# EAGLE design Grove - 12-bit Magnetic Rotary Position Sensor (AS5600) (EAGLE 9.2.2)
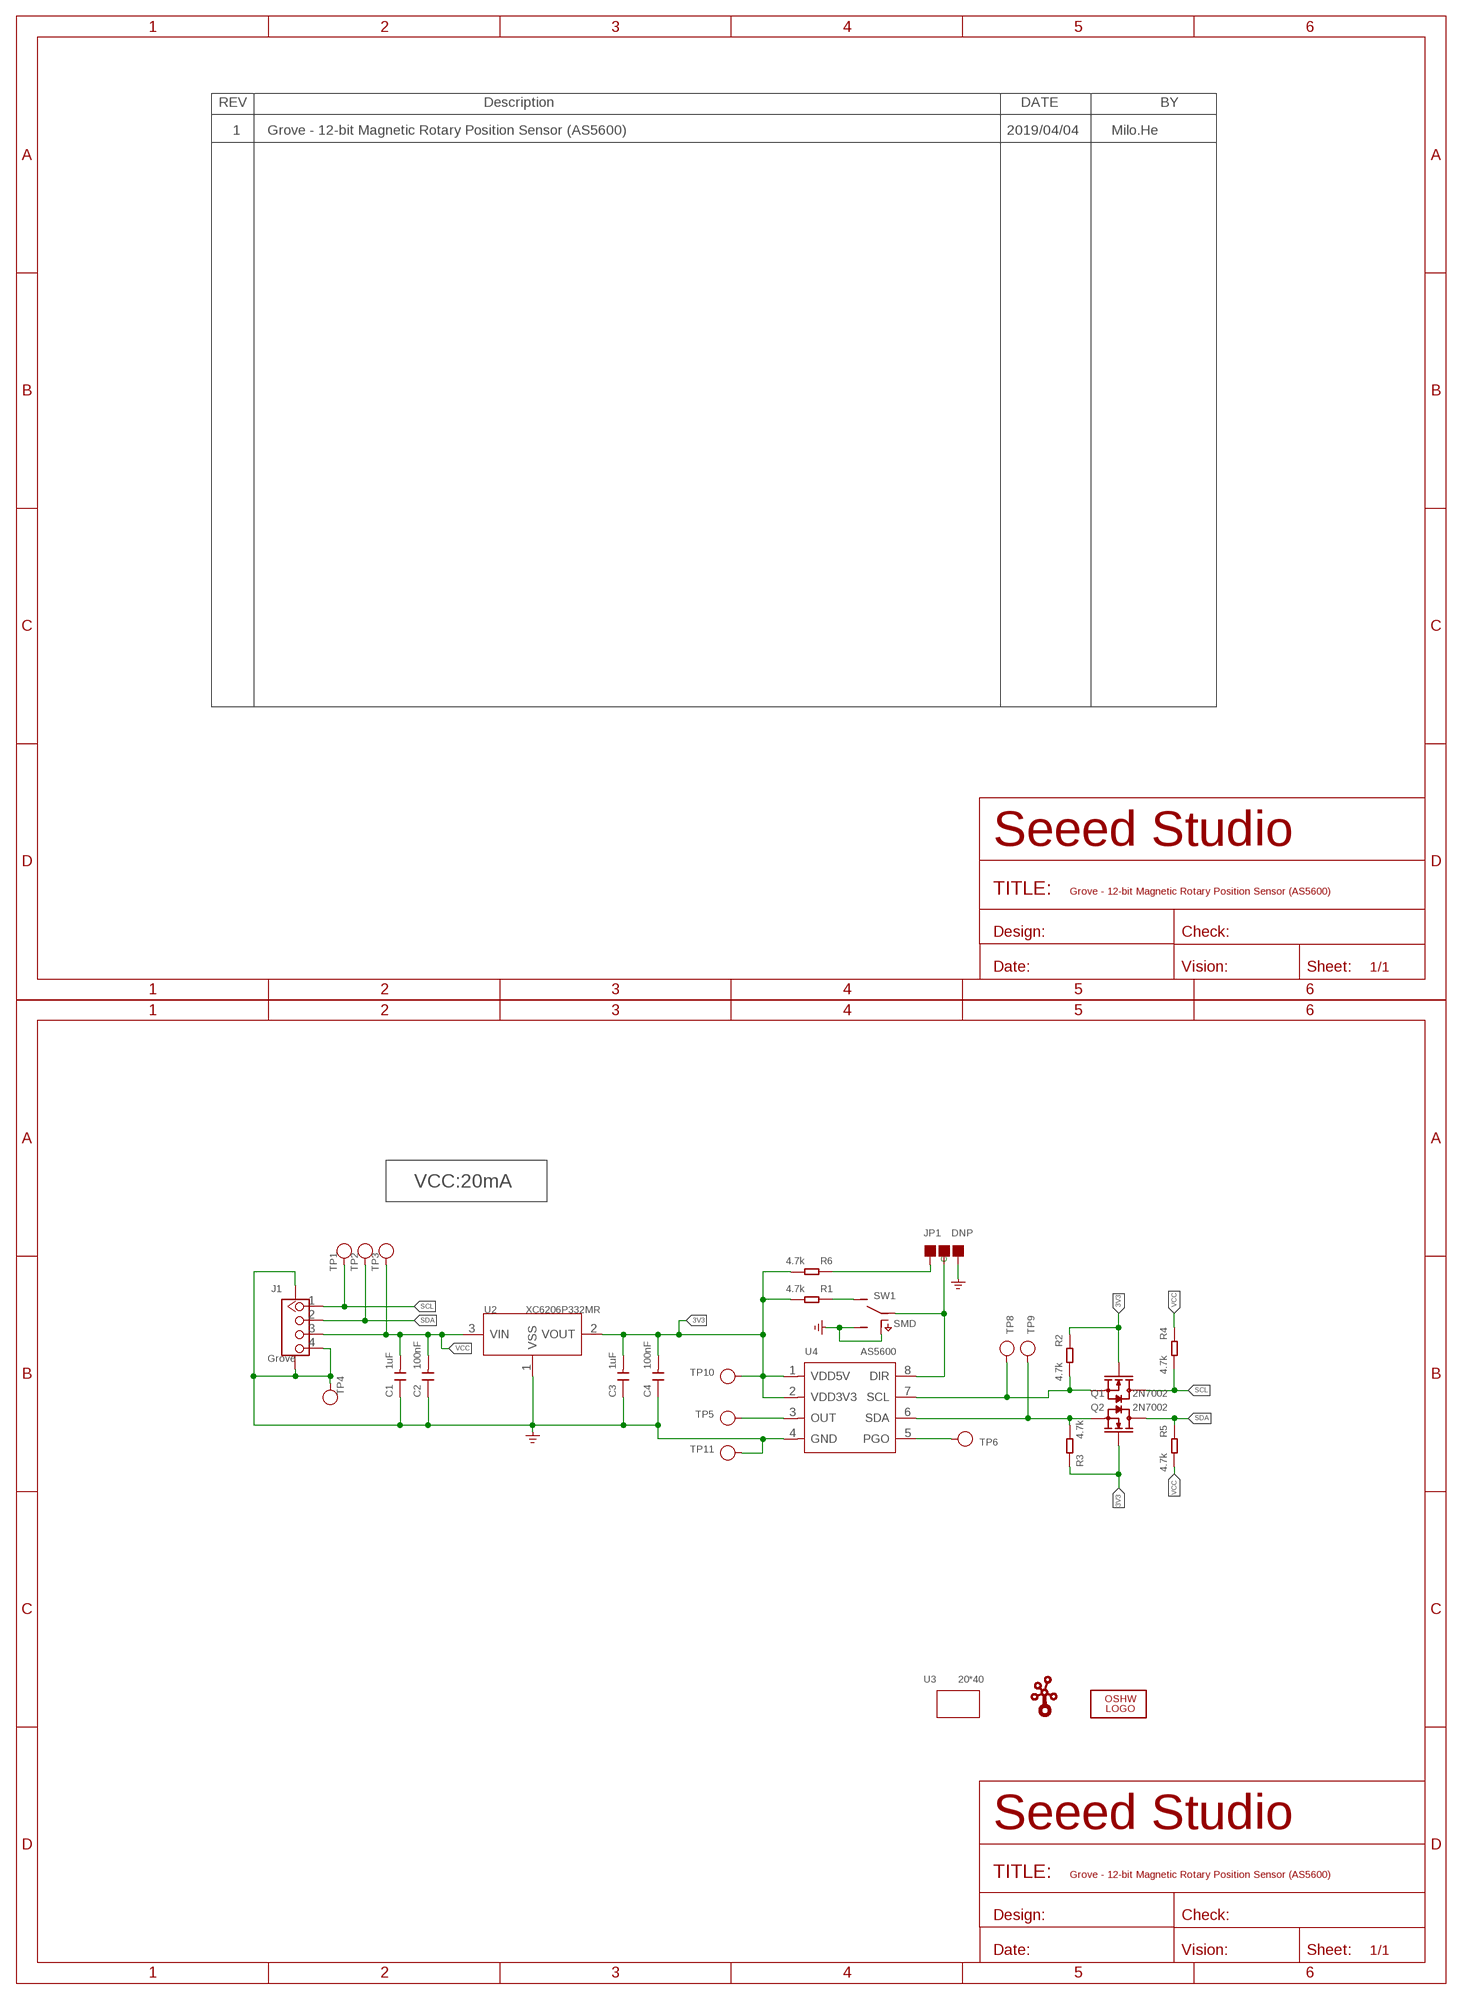
[diagram p0: schematic, sheet 1]

## Parts
C1  1uF  CAP-0402  [C0402]
C2  100nF  CAP-0402  [C0402]
C3  1uF  CAP-0402  [C0402]
C4  100nF  CAP-0402  [C0402]
J1  Grove  GROVE-CONNECTOR-SMD-320110032  [HW4-SMD-2.0-90D]
JP1  DNP  JP-3P  [3P-SMD]
LOGO1  LOGO-OSHW-FILLX0150-NT  [OSHW_FILLX150_NOTEXT]
Q1  2N7002  MOSFET-N'SI1304BDL'  [SOT-323]
Q2  2N7002  MOSFET-N'SI1304BDL'  [SOT-323]
R1  4.7k  RES-0402  [R0402]
R2  4.7k  RES-0402  [R0402]
R3  4.7k  RES-0402  [R0402]
R4  4.7k  RES-0402  [R0402]
R5  4.7k  RES-0402  [R0402]
R6  4.7k  RES-0402  [R0402]
SW1  SMD  SWITCH-3+4P-311030001  [SW7-SMD-L6.7X2.7X3.2MM]
TP1  Test  TEST-POINT'4545'  [TP-D45MIL]
TP2  Test  TEST-POINT'4545'  [TP-D45MIL]
TP3  Test  TEST-POINT'4545'  [TP-D45MIL]
TP4  Test  TEST-POINT'4545'  [TP-D45MIL]
TP5  Test  TEST-POINT'4080'  [TP-80X40MIL]
TP6  Test  TEST-POINT'4080'  [TP-80X40MIL]
TP8  Test  TEST-POINT'4080'  [TP-80X40MIL]
TP9  Test  TEST-POINT'4080'  [TP-80X40MIL]
TP10  Test  TEST-POINT'4080'  [TP-80X40MIL]
TP11  Test  TEST-POINT'4080'  [TP-80X40MIL]
U2  XC6206P332MR  PMIC-XC6206PMR  [SOT-23]
U3  20*40  GROVE-1X2-TOP  [GROVE-1*2-TEST-PLATFORM-TOP]
U4  AS5600  SENSOR-AS5600  [SOIC8-1.27-5X4MM]
U$4  LOGO-GROVETWIGLOGO_SMALL  [GROVE-SILK-SMALL]

## Nets
3V3: C3.2 C4.2 Q1.1(G) Q2.1(G) R1.2 R2.1 R3.1 R6.2 TP10.1(T) U2.2(VOUT) U4.1(VDD5V) U4.2(VDD3V3)
GND: C1.1 C2.1 C3.1 C4.1 J1.4 J1.SS1 J1.SS2 JP1.00(R) SW1.3(B) SW1.SS1(SS2) SW1.SS2 SW1.SS3(SS2) SW1.SS4(SS2) TP4.T TP11.1(T) U2.1(VSS) U4.4(GND) ; supply symbol labelled GND_POWER
N$1: TP5.1(T) U4.3(OUT)
N$2: TP6.1(T) U4.5(PGO)
N$3: JP1.11(L) R6.1
N$4: Q2.2(S) R3.2 TP9.1(T) U4.6(SDA)
N$5: JP1.MM(C) SW1.2(COM) U4.8(DIR)
N$7: R1.1 SW1.1(A)
N$8: Q1.2(S) R2.2 TP8.1(T) U4.7(SCL)
SCL: J1.1 Q1.3(D) R4.2 TP1.T
SDA: J1.2 Q2.3(D) R5.1 TP2.T
VCC: C1.2 C2.2 J1.3 R4.1 R5.2 TP3.T U2.3(VIN)

## Notes on the sheet
- 1 | Grove - 12-bit Magnetic Rotary Position Sensor (AS5600) | 2019/04/04 | Milo.He
- VCC:20mA

## Library data of the parts
C1-C4 = Discrete-new:CAP: Ceramic Capacitors
J1 = Connector-new:GROVE-CONNECTOR-SMD
JP1 = Discrete-new:JP-3P
LOGO1 = logo:LOGO-OSHW-FILL; PARTNO: DNP
Q1 Q2 = Discrete-new (何野狐 的冲突副本 2019-04-03):MOSFET-N: IRLL014: http://www.vishay.com/docs/91319/sihll014.pdf
R1-R6 = Discrete-new:RES
SW1 = Switch:SWITCH-3+4P
TP1-TP4 = Discrete-new (何野狐 的冲突副本 2019-04-03):TEST-POINT; PARTNO: DNP
TP5 TP6 TP8-TP11 = Discrete-new (何野狐 的冲突副本 2019-04-03):TEST-POINT
U2 = IC-new:PMIC-XC6206P: LOW ESR Cap.Compatible Positive Voltage Regulators
U3 = moudle-new:GROVE
U4 = Sensor:SENSOR-AS5600
U$4 = logo:LOGO-GROVE; PARTNO: DNP

## Board
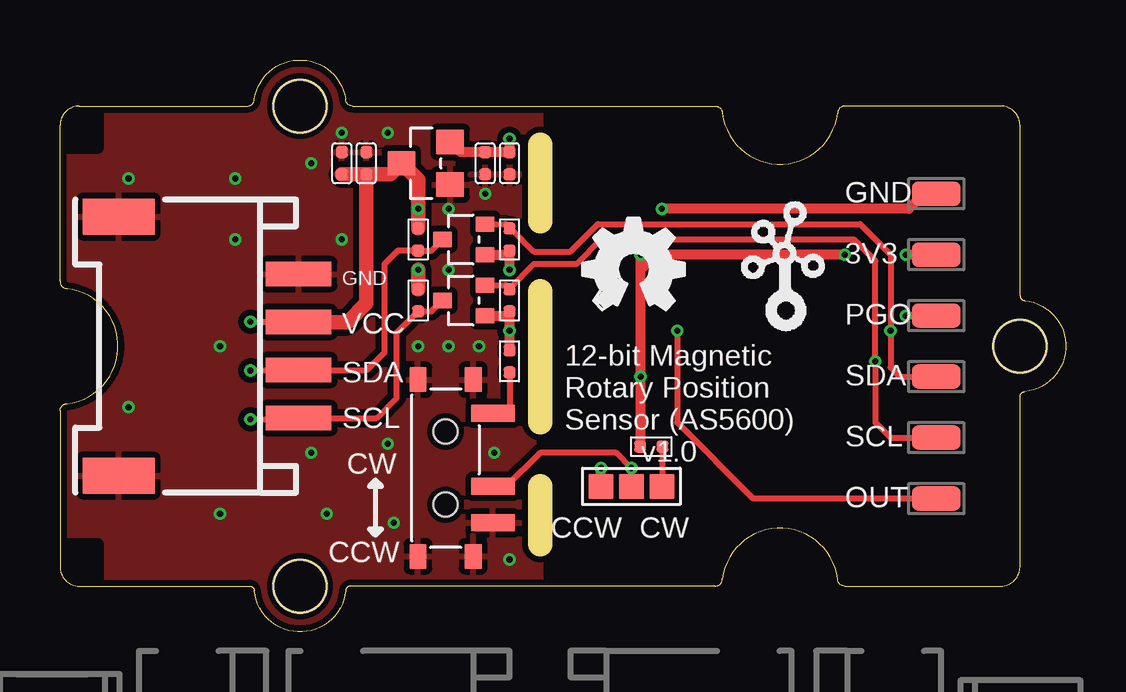
[diagram p1: board, top side]
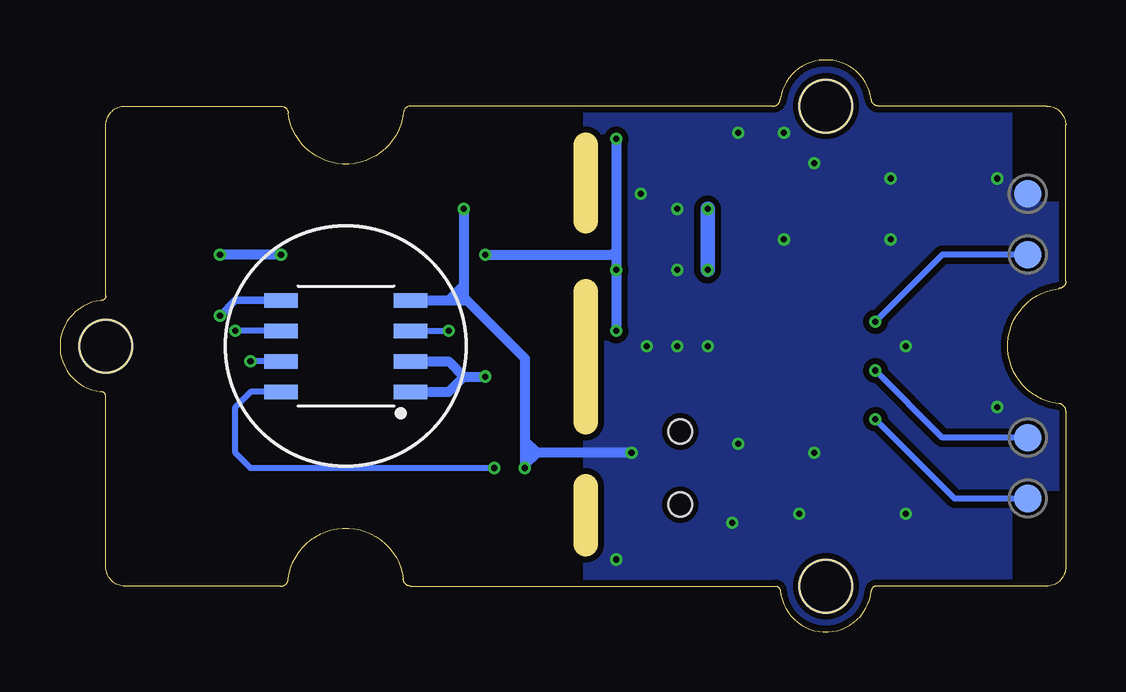
[diagram p2: board, bottom side, seen from below]

Size 41.91 x 23.83 mm. Coordinates in mm from the lower left corner, seen from the top.
Outline: 20,3.65 20,6.07
Outline: 20,17.12 20,20.29
Outline: 20,8.73 20,14.19
Copper layers (1*16): Top 0.035mm / dielectric 1.5mm / Bottom 0.035mm
Design rules "SeeedStudio_2layer_DRU_no_angle_20140221": minimum track width 1mil, minimum drill 10mil, track to track 6mil, track to pad 6mil, pad to pad 6mil, via to via 6mil, smd to smd 0mil, copper to edge 10mil, drill to drill 10mil, minimum pad ring 4mil, minimum via ring 4mil, stop-mask expansion 2mil, vias tented up to drill 25mil, thermal gap 10mil

### Footprints (pad centres in the part's own frame; a part is rotated, then mirrored left to right if it is on the bottom)
C0402 = smd 0.5 x 0.5: 1 -0.463,0; 2 0.463,0
HW4-SMD-2.0-90D = smd 1.01 x 2.74: 1 -3,-0.1; 2 -1,-0.1; 3 1,-0.1; 4 3,-0.1 | smd 1.5 x 3: SS1 -5.4,7.4; SS2 5.4,7.4
3P-SMD = smd 1.016 x 1.016: 00 -1.27,0; 11 1.27,0; MM 0,0
SOT-323 = smd 0.762 x 0.635: 1 0.889,-0.635; 2 0.889,0.635; 3 -0.889,0
R0402 = smd 0.5 x 0.5: 1 -0.463,0; 2 0.463,0
SW7-SMD-L6.7X2.7X3.2MM = smd 1.8 x 0.7: 1 1.978,2.286; 2 1.978,-0.762; 3 1.978,-2.286 | smd 0.7 x 1.016: SS1 -1.15,-3.683; SS2 1.15,-3.683; SS3 1.15,3.683; SS4 -1.15,3.683 | hole 1: 0,-1.524; 0,1.524
TP-D45MIL = smd 1.143 x 1.143: T 0,0
TP-80X40MIL = smd 2.032 x 1.016: 1 0,0
SOT-23 = smd 1.016 x 1.143: 1 -0.889,-1.016; 2 0.889,-1.016; 3 0,1.016
GROVE-1*2-TEST-PLATFORM-TOP = hole 2.2: 10.635,10; 10.635,-10; -19.365,0
SOIC8-1.27-5X4MM = smd 0.6 x 1.4: 1 -1.905,-2.7; 2 -0.635,-2.7; 3 0.635,-2.7; 4 1.905,-2.7; 5 1.905,2.7; 6 0.635,2.7; 7 -0.635,2.7; 8 -1.905,2.7

### Placement (x,y rotation side)
C1  11.74,19.53 270 top
C2  12.76,19.53 270 top
C3  18.73,19.53 90 top
C4  17.71,19.53 90 top
J1  9.84,11.91 90 top
JP1  23.81,6.07 0 top
LOGO1  21.78,13.43 0 top
Q1  16.82,13.81 0 top
Q2  16.82,16.35 0 top
R1  18.73,11.27 90 top
R2  18.73,13.81 90 top
R3  18.73,16.35 90 top
R4  14.92,13.81 270 top
R5  14.92,16.35 90 top
R6  24.64,7.72 180 top
SW1  16.06,6.83 0 top
TP1  1.59,5.56 0 bottom
TP2  1.59,8.1 0 bottom
TP3  1.59,15.72 0 bottom
TP4  1.59,18.26 0 bottom
TP5  36.51,5.56 0 top
TP6  36.51,13.18 0 top
TP8  36.51,8.1 0 top
TP9  36.51,10.64 0 top
TP10  36.51,15.72 0 top
TP11  36.51,18.26 0 top
U2  15.24,19.53 90 top
U3  20.64,11.91 180 top
U4  30,11.91 90 bottom
U$4  28,12.42 0 top

### Tracks (layer width: path | path; a pad name or v marks a point on that pad's centre or on a via)
3V3  (via drill 0.25 pad 0.51)
  Top 0.406: U2.2 16.68,19.99 C4.2 C3.2 v18.73,20.54 | Q1.1 18.56,13.18 R2.1 v18.73,12.54 R1.2 | Q2.1 18.56,15.72 R3.1 v18.73,15.08 | R6.2 24.19,7.86 v24.19,10.64 24.19,15.08 | TP10.1 v35.24,15.72 | v32.7,15.72 24.83,15.72 | 24.83,15.72 24.19,15.08 | 24.19,15.08 v24.19,15.72 24.83,15.72
  Bottom 0.406: v18.73,20.54 R3.1 | R3.1 v18.73,15.08 v18.73,12.54 | U4.1 25.71,10 25.08,10.64 | U4.2 25.71,11.27 25.08,10.64 | 25.08,10.64 v24.19,10.64 | v24.19,15.72 18.9,15.72 R3.1 | v32.7,15.72 v35.24,15.72
GND  (via drill 0.25 pad 0.51)
  Top 0.406: JP1.00 v22.54,6.83 | TP11.1 36,18.26 35.37,17.62 v25.08,17.62
  Bottom 0.406: U4.4 25.71,13.81 | 25.71,13.81 24.95,13.81 | 24.95,13.81 22.54,11.4 22.54,7.97 | 22.54,7.97 22.54,7.46 | 22.54,7.46 22.54,6.96 | 22.54,6.96 v22.54,6.83 | v18.09,7.46 22.03,7.46 | 22.03,7.46 22.54,7.46 | v25.08,17.62 25.08,14.45 | 25.08,14.45 25.08,13.94 24.95,13.81 | 25.71,13.81 25.08,14.45 | 22.03,7.46 22.54,7.97 | 22.03,7.46 22.54,6.96
  other vias: 17.71,18.26 17.46,11.91 14.92,11.91 16.19,11.91 16.19,15.08 16.19,17.62 18.73,3.02 13.65,7.84 10.47,7.46 6.66,11.91 11.74,16.35 7.3,16.35 11.74,20.8 13.65,20.8 13.9,4.54 6.66,4.92 2.86,9.37 2.86,18.89 10.47,19.53 7.3,18.89 11.11,4.92
  pour Bottom (isolate 0.254): -0.32,23.97 20,23.97 20,-0.16 -0.32,-0.16
  pour Top (isolate 0.254): -0.32,23.97 20,23.97 20,-0.16 -0.32,-0.16
N$1  (via drill 0.25 pad 0.51)
  Top 0.254: v25.71,12.54 25.71,8.73 28.89,5.56 TP5.1
  Bottom 0.254: U4.3 v25.71,12.54
N$2  (via drill 0.25 pad 0.51)
  Top 0.305: v35.24,13.18 TP6.1
  Bottom 0.305: U4.5 34.61,13.81 v35.24,13.18
N$3
  Top 0.254: R6.1 25.1,6.21
  Top 0.305: 25.1,6.21 JP1.11
N$4  (via drill 0.25 pad 0.51)
  Top 0.254: Q2.2 18.56,16.99 R3.2 18.78,16.82 19.75,15.85 21.27,15.85 22.41,16.99 33.34,16.99 34.61,15.72 v34.61,12.54 34.61,11.02 34.99,10.64 TP9.1
  Bottom 0.254: U4.6 v34.61,12.54
N$5  (via drill 0.25 pad 0.51)
  Top 0.254: SW1.2 18.6,6.07 20,7.46 23.18,7.46 v23.81,6.83 JP1.MM
  Bottom 0.254: v23.81,6.83 33.97,6.83 34.61,7.46 34.61,9.37 33.97,10 U4.8
N$7
  Top 0.254: R1.1 18.73,9.11 SW1.1
N$8  (via drill 0.25 pad 0.51)
  Top 0.254: Q1.2 18.56,14.45 R2.2 18.73,14.32 19.75,15.34 21.52,15.34 22.54,16.35 33.08,16.35 33.97,15.46 v33.97,11.27 33.97,8.73 34.61,8.1 TP8.1
  Bottom 0.254: U4.7 v33.97,11.27
SCL  (via drill 0.25 pad 0.51)
  Top 0.254: Q1.3 15.47,13.35 R4.2 14.03,12.46 14.03,9.75 13.19,8.91 J1.1 | v7.94,8.86 9.89,8.86
  Top 0.305: 9.89,8.86 J1.1
  Bottom 0.254: TP1.T 4.63,5.56 v7.94,8.86
SDA  (via drill 0.25 pad 0.51)
  Top 0.254: Q2.3 15.47,15.89 R5.1 14.08,15.89 13.52,15.34 13.52,11.65 12.78,10.91 J1.2 | v7.94,10.89 9.92,10.89
  Top 0.305: 9.92,10.89 J1.2
  Bottom 0.254: TP2.T 5.14,8.1 v7.94,10.89
VCC  (via drill 0.25 pad 0.51)
  Top 0.254: v7.94,12.92 9.92,12.92
  Top 0.305: 9.92,12.92 J1.3
  Top 0.61: J1.3 11.98,12.91 12.76,13.69 C2.2 | C1.2 C2.2 | C2.2 13.76,19.07 U2.3 14.92,18.83 v14.92,17.62 R5.2 | R4.1 v14.92,15.08
  Bottom 0.254: TP3.T 5.14,15.72 v7.94,12.92
  Bottom 0.61: v14.92,15.08 v14.92,17.62

### Text on the board
tNames: GND | GND | 3V3 | VCC | PGO | SDA | SDA | SCL | CW | SCL | 12-bit Magnetic / Rotary Position / Sensor (AS5600) / v1.0 | CCW | CW | OUT | CCW